# EAGLE design gyro (EAGLE 9.4.2)
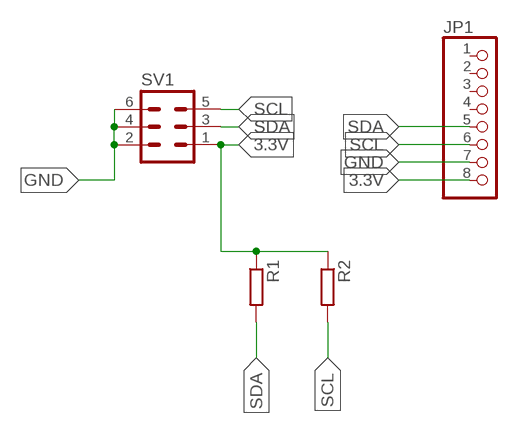
[diagram p0: schematic, sheet 1]

## Parts
JP1  PINHD-1X8  [1X08]
R1  R-EU_0309/12  [0309/12]
R2  R-EU_0309/12  [0309/12]
SV1  ML6  [ML6]

## Nets
3.3V: JP1.8 R1.1 R2.1 SV1.1
GND: JP1.7 SV1.2 SV1.4 SV1.6
SCL: JP1.6 R2.2 SV1.5
SDA: JP1.5 R1.2 SV1.3
Unconnected: JP1.1 JP1.2 JP1.3 JP1.4

## Library data of the parts
JP1 = pinhead:PINHD-1X8: PIN HEADER
R1 R2 = rcl:R-EU_: RESISTOR, European symbol; SPICEPREFIX: R
SV1 = con-ml:ML6: HARTING; OC_FARNELL: unknown; OC_NEWARK: unknown

## Board
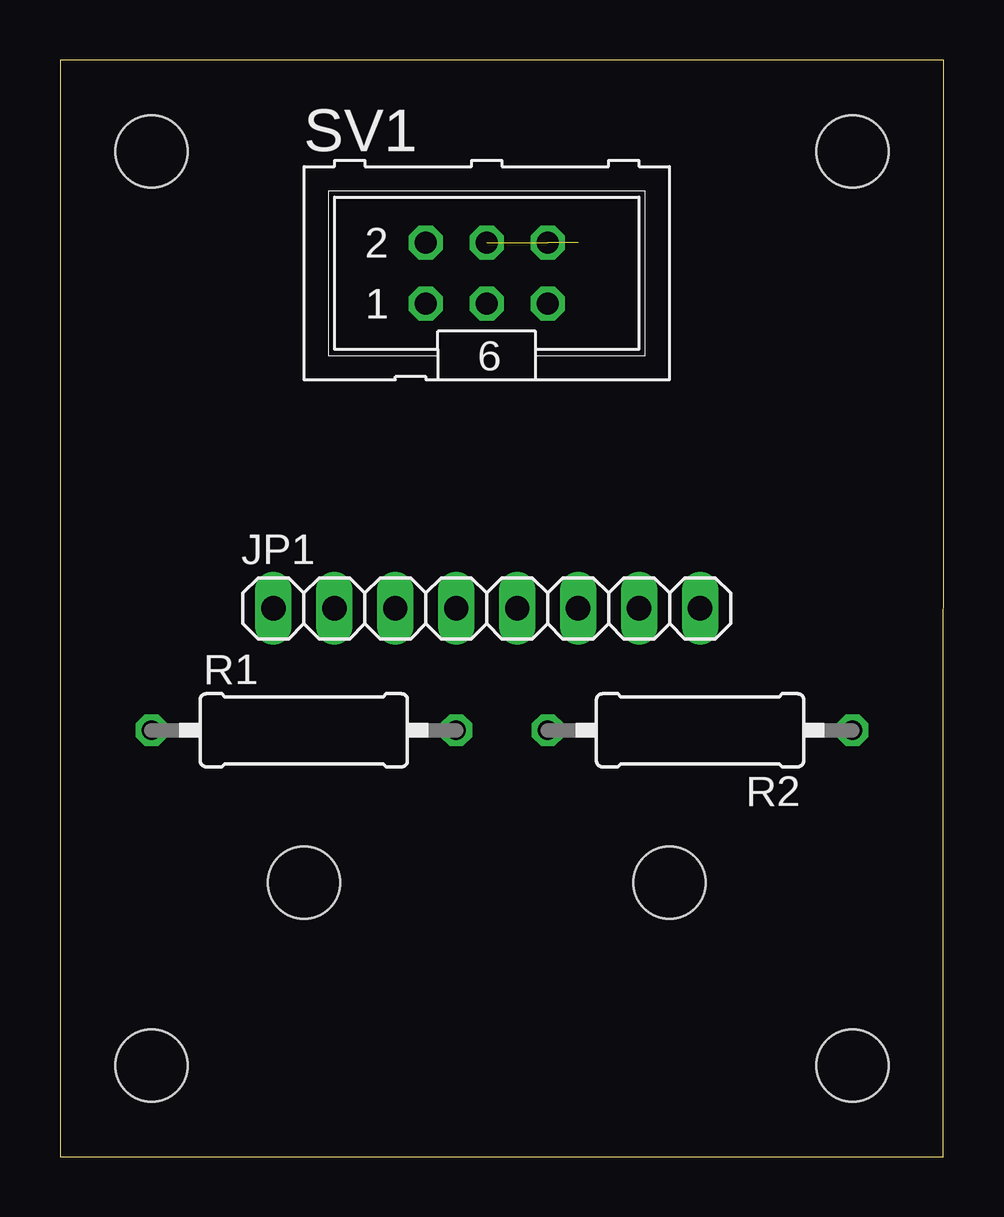
[diagram p1: board, top side]
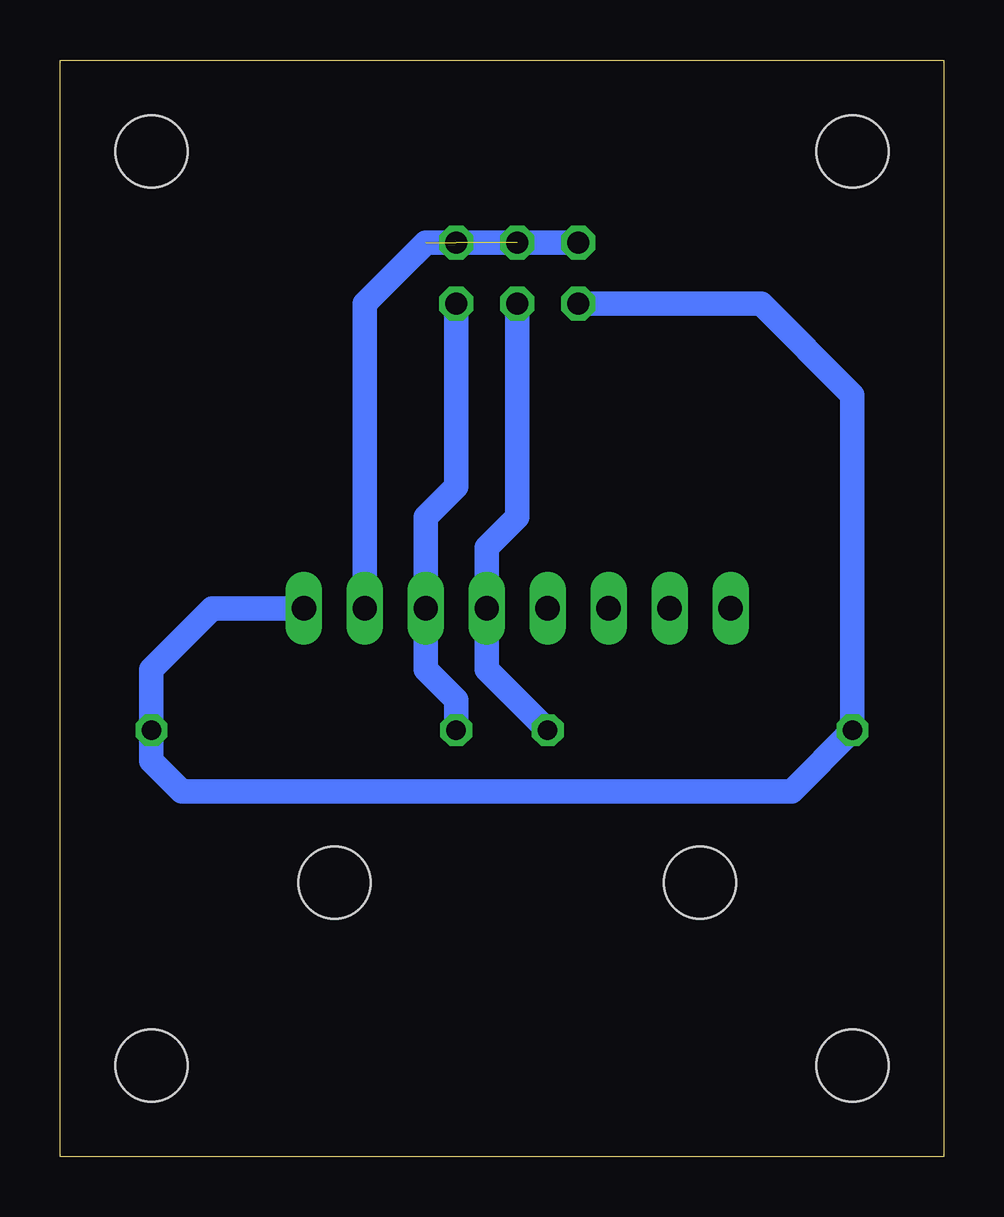
[diagram p2: board, bottom side, seen from below]

Size 36.83 x 45.72 mm. Coordinates in mm from the lower left corner, seen from the top.
Outline: 0,0 36.81,0 36.83,45.72 0,45.72 0,0
Copper layers (1*16): Top 0.035mm / dielectric 1.5mm / Bottom 0.035mm
Design rules "default": minimum track width 6mil, minimum drill 0.35mm, track to track 6mil, track to pad 6mil, pad to pad 6mil, via to via 6mil, smd to smd 6mil, copper to edge 40mil, drill to drill 6mil, minimum pad ring 10mil, minimum via ring 8mil, stop-mask expansion 4mil, vias tented up to drill 0mil, thermal gap 10mil
Holes 3 mm at 10.16,11.43 25.4,11.43 3.81,3.81 33.02,3.81 3.81,41.91 33.02,41.91

### Footprints (pad centres in the part's own frame; a part is rotated, then mirrored left to right if it is on the bottom)
1X08 = drill 1.016 long: 1 -8.89,0; 2 -6.35,0; 3 -3.81,0; 4 -1.27,0; 5 1.27,0; 6 3.81,0; 7 6.35,0; 8 8.89,0
0309/12 = drill 0.813 octagon: 1 -6.35,0; 2 6.35,0
ML6 = drill 0.914 octagon: 1 -2.54,-1.27; 2 -2.54,1.27; 3 0,-1.27; 4 0,1.27; 5 2.54,-1.27; 6 2.54,1.27

### Placement (x,y rotation side)
JP1  17.78,22.86 0 top
R1  10.16,17.78 0 top
R2  26.67,17.78 180 top
SV1  17.78,36.83 0 top

### Tracks (layer width: path | path; a pad name or v marks a point on that pad's centre or on a via)
3.3V
  Bottom 1.016: SV1.1 7.62,35.56 3.81,31.75 R1.1 6.35,15.24 31.75,15.24 33.02,16.51 R2.1 33.02,20.32 30.48,22.86 JP1.8
GND  (2 unrouted)
  Bottom 1.016: SV1.2 21.59,38.1 24.13,35.56 JP1.7
SCL
  Bottom 1.016: SV1.5 20.32,27.94 21.59,26.67 JP1.6 21.59,20.32 20.32,19.05 R2.2
SDA
  Bottom 1.016: SV1.3 17.78,26.67 19.05,25.4 JP1.5 19.05,20.32 R1.2